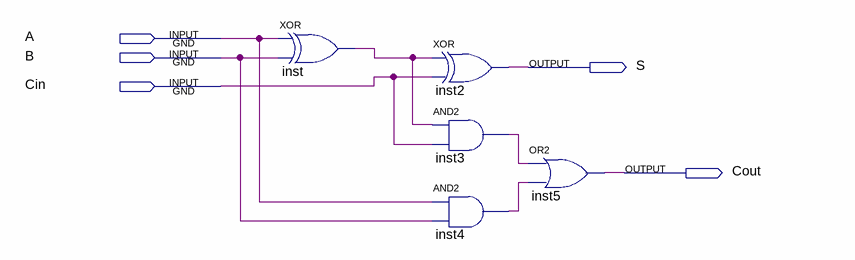
[diagram p0: schematic sheet]
// Quartus schematic add_1.bdf as structural Verilog: 5 symbols, 5 pins
module add_1 (
  input  A,
  input  B,
  input  Cin,
  output S,
  output Cout
);

  wire inst3_out, inst4_out, inst_out;

  xor inst (inst_out, A, B);
  xor inst2 (S, inst_out, Cin);
  and inst3 (inst3_out, inst_out, Cin);
  and inst4 (inst4_out, A, B);
  or inst5 (Cout, inst3_out, inst4_out);
endmodule
